# EAGLE design TSS_Rev3 (EAGLE 7.5.0)
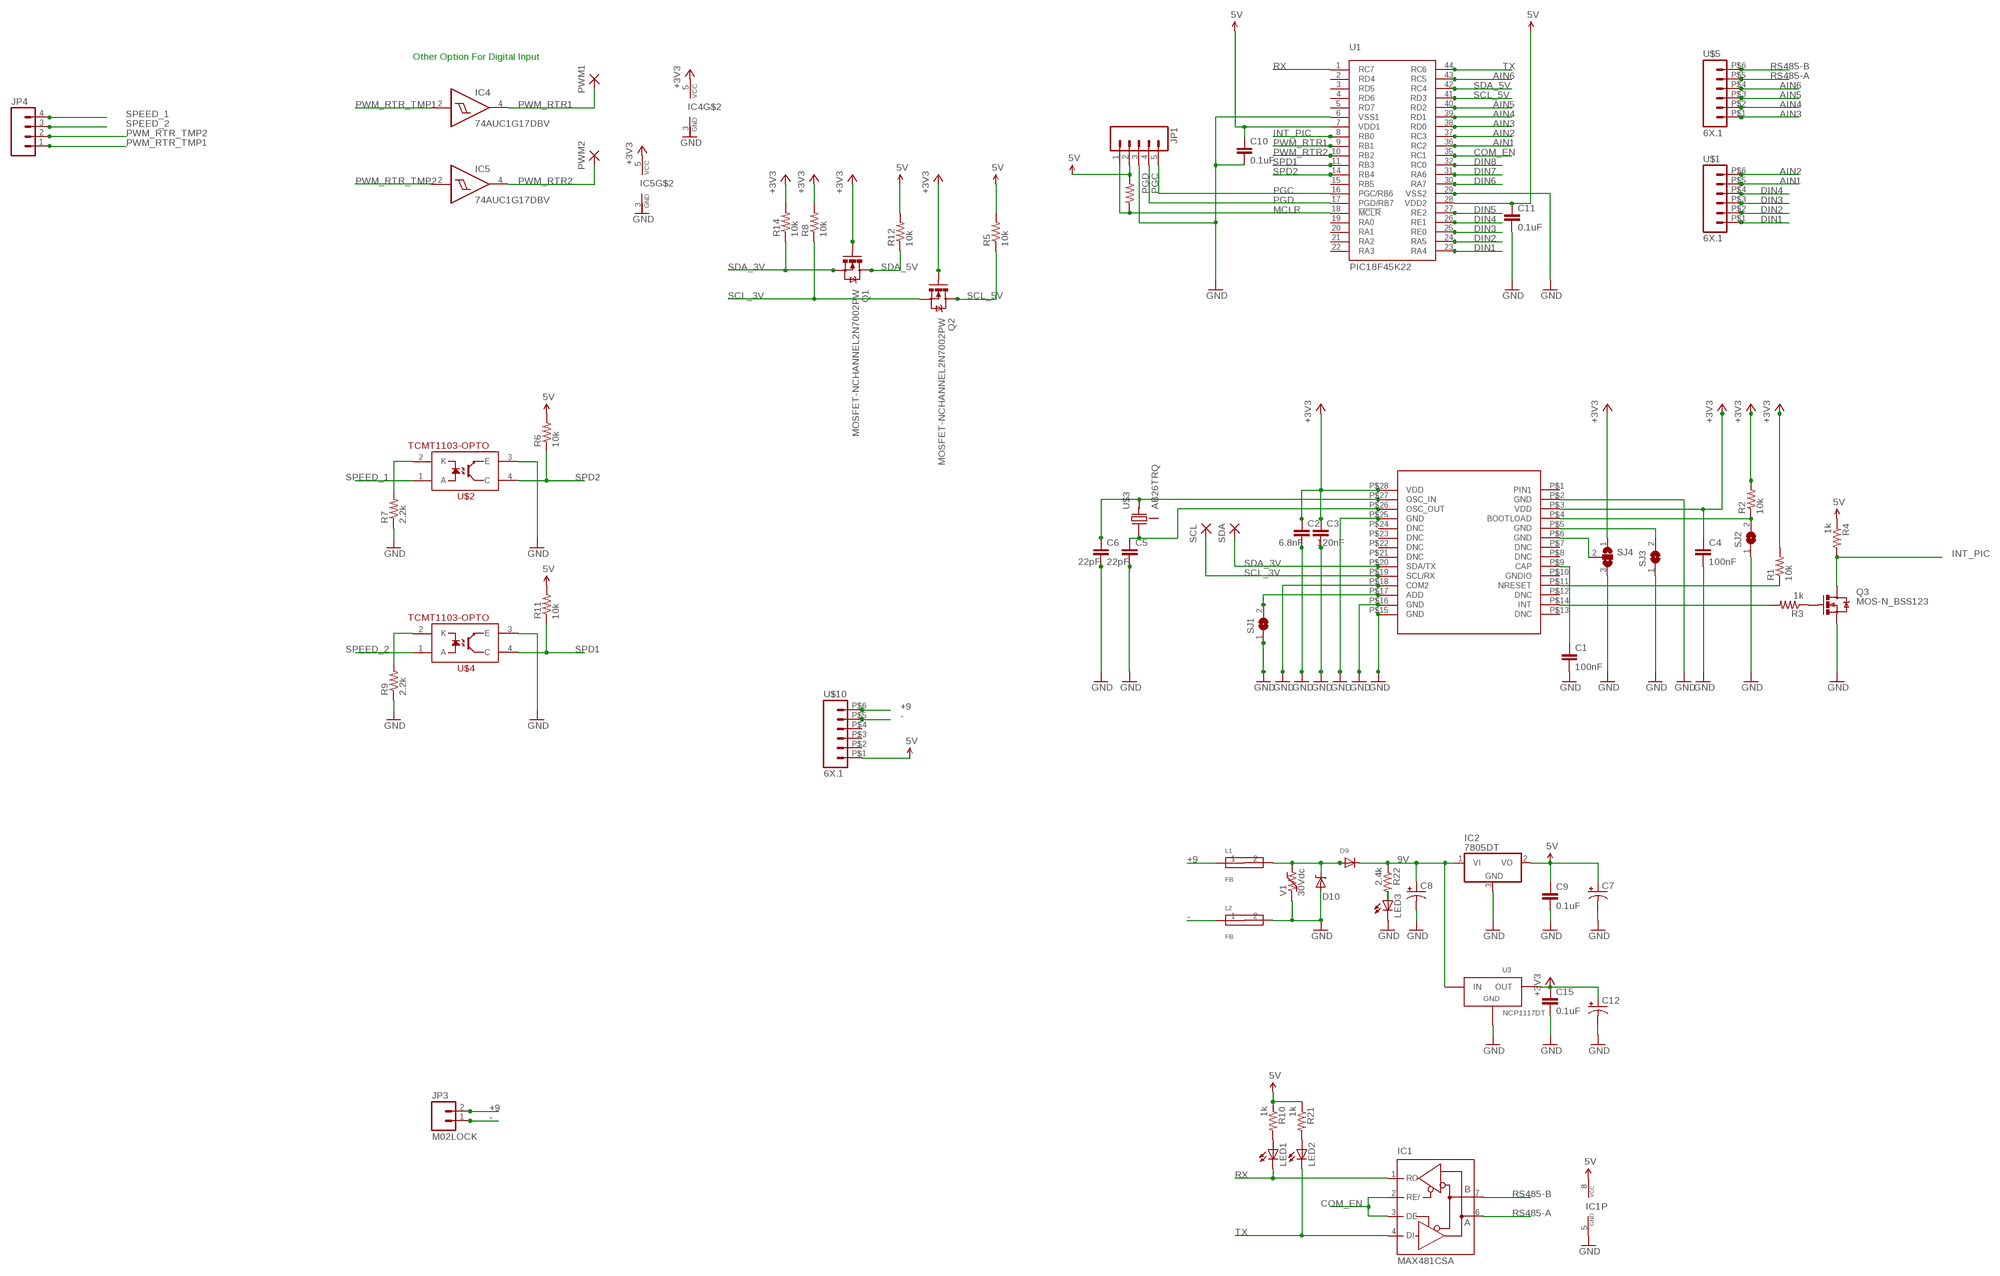
[diagram p0: schematic, sheet 1]

## Parts
C1  100nF  CAP0805  [0805]
C2  6.8nF  CAP0805  [0805]
C3  120nF  CAP0805  [0805]
C4  100nF  CAP0805  [0805]
C5  22pF  CAP0805  [0805]
C6  22pF  CAP0805  [0805]
C7  CPOL-USCT3528  [CT3528]
C8  CAP_POL7343  [EIA7343]
C9  0.1uF  CAP0805  [0805]
C10  0.1uF  CAP0805  [0805]
C11  0.1uF  CAP0805  [0805]
C12  CPOL-USCT3528  [CT3528]
C15  0.1uF  CAP0805  [0805]
D9  DIODESOD-123  [SOD-123]
D10  MM5Z30  [SOD-523F]
IC1  MAX481CSA  [SO08]
IC2  7805DT  [TO252]
IC4  74AUC1G17DBV  [SOT23-5]
IC5  74AUC1G17DBV  [SOT23-5]
JP1  M05LOCK  [1X05_LOCK]
JP3  M02LOCK  [1X02_LOCK]
JP4  M04LOCK  [1X04_LOCK]
L1  FB  FERITEBEAD  [0603]
L2  FB  FERITEBEAD  [0603]
LED1  LEDCHIP-LED0805  [CHIP-LED0805]
LED2  LEDCHIP-LED0805  [CHIP-LED0805]
LED3  LEDCHIP-LED0805  [CHIP-LED0805]
PWM1  TPSMD  [0603]
PWM2  TPSMD  [0603]
Q1  MOSFET-NCHANNEL2N7002PW  [SOT323]
Q2  MOSFET-NCHANNEL2N7002PW  [SOT323]
Q3  MOS-N_BSS123  [SOT23]
R1  10k  RESISTOR0805-RES  [0805]
R2  10k  RESISTOR0805-RES  [0805]
R3  1k  RESISTOR0805-RES  [0805]
R4  1k  RESISTOR0805-RES  [0805]
R5  10k  RESISTOR0805-RES  [0805]
R6  10k  RESISTOR0805-RES  [0805]
R7  2.2k  RESISTOR0805-RES  [0805]
R8  10k  RESISTOR0805-RES  [0805]
R9  2.2k  RESISTOR0805-RES  [0805]
R10  1k  RESISTOR0805-RES  [0805]
R11  10k  RESISTOR0805-RES  [0805]
R12  10k  RESISTOR0805-RES  [0805]
R13  10k  RESISTOR0805-RES  [0805]
R14  10k  RESISTOR0805-RES  [0805]
R21  1k  RESISTOR0805-RES  [0805]
R22  2.4k  RESISTOR0805-RES  [0805]
SCL  TPSMD  [0603]
SDA  TPSMD  [0603]
SJ1  SJ  [SJ]
SJ2  SJ  [SJ]
SJ3  SJ  [SJ]
SJ4  SJ2W  [SJ_2]
U1  PIC18F45K22  [TQFP-44]
U2  BOSCH_IMUSURFACEMOUNT  [LGA_28]
U3  NCP1117DT  [DPAK]
U$1  6X.1  [1X06]
U$2  TCMT1103-OPTO  [SSOP-4]
U$3  AB26TRQ  [3PAD_CAN]
U$4  TCMT1103-OPTO  [SSOP-4]
U$5  6X.1  [1X06]
U$10  6X.1  [1X06]
V1  30Vdc  VAR-RES  [0603]

## Nets
5V: C7.+ C9.1 C10.1 C11.1 IC1.8(VCC) IC2.2(VO) JP1.2 R4.1 R5.2 R6.2 R10.1 R11.2 R12.2 R13.2 R21.1 U1.7(VDD1) U1.28(VDD2) U$10.P$1
9V: C8.A(+) D9.C IC2.1(VI) R22.1 U3.3(IN)
+3V3: C2.1 C3.1 C4.1 C12.+ C15.1 IC4.5(VCC) IC5.5(VCC) Q1.1(G) Q2.1(G) R1.2 R2.2 R8.2 R14.2 SJ4.1 U2.P$3(VDD) U2.P$28(VDD) U3.2(OUT)
+9: JP3.2 L1.1 U$10.P$6
-: JP3.1 L2.1 U$10.P$5
AIN1: U1.36(RC2) U$1.P$5
AIN2: U1.37(RC3) U$1.P$6
AIN3: U1.38(RD0) U$5.P$1
AIN4: U1.39(RD1) U$5.P$2
AIN5: U1.40(RD2) U$5.P$3
AIN6: U1.43(RC5) U$5.P$4
COM_EN: IC1.2(RE/) IC1.3(DE) U1.35(RC1)
DIN1: U1.23(RA4) U$1.P$1
DIN2: U1.24(RA5) U$1.P$2
DIN3: U1.25(RE0) U$1.P$3
DIN4: U1.26(RE1) U$1.P$4
DIN5: U1.27(RE2)
DIN6: U1.30(RA7)
DIN7: U1.31(RA6)
DIN8: U1.32(RC0)
GHT: D9.A D10.C L1.2 V1.2
GND: C1.2 C2.2 C3.2 C4.2 C5.2 C6.2 C7.- C8.C(-) C9.2 C10.2 C11.2 C12.- C15.2 D10.A IC1.5(GND) IC2.3(GND) JP1.3 L2.2 LED3.C Q3.2(S) R7.1 R9.1 SJ1.1 SJ2.1 SJ3.1 SJ4.3 U1.6(VSS1) U1.29(VSS2) U2.P$2(GND) U2.P$15(GND) U2.P$16(GND) U2.P$18(COM2) U2.P$25(GND) U3.1(GND) U$2.3(E) U$4.3(E) V1.1
INT_PIC: Q3.3(D) R4.2 U1.8(RB0)
MCLR: JP1.1 R13.1 U1.18(!MCLR)
N$1: SJ3.2 U2.P$5(GND)
N$2: R2.1 SJ2.2 U2.P$4(BOOTLOAD)
N$3: SJ4.2 U2.P$6(GND)
N$4: LED3.A R22.2
N$5: LED1.A R10.2
N$6: LED2.A R21.2
N$10: C6.1 U2.P$27(OSC_IN) U$3.2(OUT)
N$11: C5.1 U2.P$26(OSC_OUT) U$3.1(IN)
N$12: R7.2 U$2.2(K)
N$13: SJ1.2 U2.P$17(ADD)
N$14: R9.2 U$4.2(K)
N$15: R3.2 U2.P$14(INT)
N$16: C1.1 U2.P$9(CAP)
N$17: R1.1 U2.P$11(NRESET)
N$18: Q3.1(G) R3.1
PGC: JP1.5 U1.16(PGC/RB6)
PGD: JP1.4 U1.17(PGD/RB7)
PWM_RTR1: IC4.4(O) PWM1.1 PWM1.2 U1.9(RB1)
PWM_RTR2: IC5.4(O) PWM2.1 PWM2.2 U1.10(RB2)
PWM_RTR_TMP1: IC4.2(I) JP4.1
PWM_RTR_TMP2: IC5.2(I) JP4.2
RS485-A: IC1.6(A) U$5.P$5
RS485-B: IC1.7(B) U$5.P$6
RX: IC1.1(RO) LED1.C U1.1(RC7)
SCL_3V: Q2.2(S) R8.1 SCL.1 SCL.2 U2.P$19(SCL/RX)
SCL_5V: Q2.3(D) R5.1 U1.41(RD3)
SDA_3V: Q1.2(S) R14.1 SDA.1 SDA.2 U2.P$20(SDA/TX)
SDA_5V: Q1.3(D) R12.1 U1.42(RC4)
SPD1: R11.1 U1.11(RB3) U$4.4(C)
SPD2: R6.1 U1.14(RB4) U$2.4(C)
SPEED_1: JP4.4 U$2.1(A)
SPEED_2: JP4.3 U$4.1(A)
TX: IC1.4(DI) LED2.C U1.44(RC6)
Unconnected: U1.2(RD4) U1.3(RD5) U1.4(RD6) U1.5(RD7) U1.15(RB5) U1.19(RA0) U1.20(RA1) U1.21(RA2) U1.22(RA3) U2.P$1(PIN1) U2.P$7(DNC) U2.P$8(DNC) U2.P$10(GNDIO) U2.P$12(DNC) U2.P$13(DNC) U2.P$21(DNC) U2.P$22(DNC) U2.P$23(DNC) U2.P$24(DNC) U$3.CASE(GND) U$10.P$2 U$10.P$3 U$10.P$4

## Notes on the sheet
- Other Option For Digital Input

## Power pins joined to a net without a drawn wire
GND: IC4.3(GND) IC5.3(GND)

## Library data of the parts
C1-C6 C9-C11 C15 = SparkFun-Passives:CAP: Capacitor Standard 0603 ceramic capacitor, and 0.1" leaded capacitor.
C7 C12 = adafruit:CPOL-US: POLARIZED CAPACITOR, American symbol
C8 = SparkFun-Passives:CAP_POL: Capacitor Polarized These are standard SMD and PTH capacitors. Normally 10uF, 47uF, and 100uF in electrolytic and tantalum varieties. Always verify the external diameter of the through hole cap, it varies with capacity, voltage, and manufacturer. The EIA devices should be standard.
D9 = adafruit:DIODE: Diode SMADIODE - SMA Surface Mount Package 20V 1A Schottky Diode Digikey: 641-1014-6-ND DO-1N4148 - Through Hole Small Current Diode SOD-123 20V 1 A (.5mV Vf) Schottky Diode - Digikey: MBRX120TPMSCT-ND SOD-323 10V 570mA (.38mV Vf, 3ns) Schottky Diode - Digikey: ZLLS410CT-ND SOD-523 30V 30mA Schottky Diode (RB751S-40TE61) - Digikey: RB751S-40TE61CT-ND SOT23-R/W - SOT23 Package (R = Solder Paste/Reflow Ovens, W = Hand-Soldering) BAT54Film 40V 300mA - Digikey: 497-7162-1-ND
D10 = EmEndev:MM5Z30
IC1 = maxim:MAX481CSA: RS485 TRANSEIVER; MF: MAXIM; MPN: MAX481CSA; OC_FARNELL: unknown; OC_NEWARK: 90C3817
IC2 = adafruit:78*: Positive VOLTAGE REGULATOR Added bigger pads to the TO-92 package
IC4 IC5 = 74xx-little-us:74*1G17: Single Schmitt-Trigger Buffer
JP1 = SparkFun-Connectors:M05: Header 5 Standard 5-pin 0.1" header. Use with straight break away headers (SKU : PRT-00116), right angle break away headers (PRT-00553), swiss pins (PRT-00743), machine pins (PRT-00117), and female headers (PRT-00115). Molex polarized connector foot print use with SKU : PRT-08230 with associated crimp pins and housings.
JP3 = SparkFun-Connectors:M02: Standard 2-pin 0.1" header. Use with - straight break away headers ( PRT-00116) - right angle break away headers (PRT-00553) - swiss pins (PRT-00743) - machine pins (PRT-00117) - female headers (PRT-00115) Molex polarized connector foot print use with: PRT-08233 with associated crimp pins and housings. 2.54_SCREWTERM for use with PRT-10571. 3.5mm Screw Terminal footprints for PRT-08084 5mm Screw Terminal footprints for use with PRT-08432
JP4 = SparkFun-Connectors:M04: Header 4 Standard 4-pin 0.1" header. Use with straight break away headers (SKU : PRT-00116), right angle break away headers (PRT-00553), swiss pins (PRT-00743), machine pins (PRT-00117), and female headers (PRT-00115). Molex polarized connector foot print use with SKU : PRT-08231 with associated crimp pins and housings. 1MM SMD Version SKU: PRT-10208
L1 L2 = EmEndev:FERITEBEAD
LED1-LED3 = adafruit:LED: LED OSRAM: - CHIPLED LG R971, LG N971, LY N971, LG Q971, LY Q971, LO R971, LY R971 LH N974, LH R974 LS Q976, LO Q976, LY Q976 LO Q996 - Hyper CHIPLED LW Q18S LB Q993, LB Q99A, LB R99A - SideLED LS A670, LO A670, LY A670, LG A670, LP A670 LB A673, LV A673, LT A673, LW A673 LH A674 LY A675 LS A676, LA A676, LO A676, LY A676, LW A676 LS A679, LY A679, LG A679 - Hyper Micro SIDELED® LS Y876, LA Y876, LO Y876, LY Y876 LT Y87S - SmartLED LW L88C, LW L88S LB L89C, LB L89S, LG L890 LS L89K, LO L89K, LY L89K LS L896, LA L896, LO L896, LY L896 - TOPLED LS T670, LO T670, LY T670, LG T670, LP T670 LSG T670, LSP T670, LSY T670, LOP T670, LYG T670 LG T671, LOG T671, LSG T671 LB T673, LV T673, LT T673, LW T673 LH T674 LS T676, LA T676, LO T676, LY T676, LB T676, LH T676, LSB T676, LW T676 LB T67C, LV T67C, LT T67C, LS T67K, LO T67K, LY T67K, LW E67C LS E67B, LA E67B, LO E67B, LY E67B, LB E67C, LV E67C, LT E67C LW T67C LS T679, LY T679, LG T679 LS T770, LO T770, LY T770, LG T770, LP T770 LB T773, LV T773, LT T773, LW T773 LH T774 LS E675, LA E675, LY E675, LS T675 LS T776, LA T776, LO T776, LY T776, LB T776 LHGB T686 LT T68C, LB T68C - Hyper Mini TOPLED® LB M676 - Mini TOPLED Santana® LG M470 LS M47K, LO M47K, LY M47K Source: http://www.osram.convergy.de/
PWM1 PWM2 SCL SDA = FSAE Electric:TP: SMD test points to make life easy to test / debug; PARTNO: 1625854-3
Q1 Q2 = SparkFun-DiscreteSemi:MOSFET-NCHANNEL: Common NMOSFET Parts MFG P/N Store ID Prod ID FDD8780 TRANS-09984 SI7820DN TRANS-11055 FDS6630A IC-08089 2N7002PW TRANS-11151 FQP30N06L COM-10213 TRANS-10060 BSS123LT1G TRANS-08345 BSS138 TRANS-00830 BS170 2N7000; PROD_ID: TRANS-11151
Q3 = FSAE Electric:MOS-N: N-Channel Mosfets; PARTNO: BSS123,215
R1-R14 R21 R22 = SparkFun-Passives:RESISTOR: Resistor Basic schematic elements and footprints for 0603, 1206, and PTH resistors.
SJ1-SJ3 = jumper:SJ: SMD solder JUMPER
SJ4 = jumper:SJ2W: SMD solder JUMPER
U1 = FSAE Eletric:PIC18F45K22
U2 = Drockton:BOSCH_IMU
U3 = FSAE Eletric:NCP1117DT
U$1 U$5 U$10 = FSAE Electric:6X.1: 6x1 .1 header; PARTNO: 952-2270-ND
U$2 U$4 = SparkFun-DiscreteSemi:TCMT1103-OPTO: Optoisolator- NPN output
U$3 = FSAE Electric:AB26TRQ; PARTNO: 535-12051-1-ND
V1 = EmEndev:VAR-RES

## Board
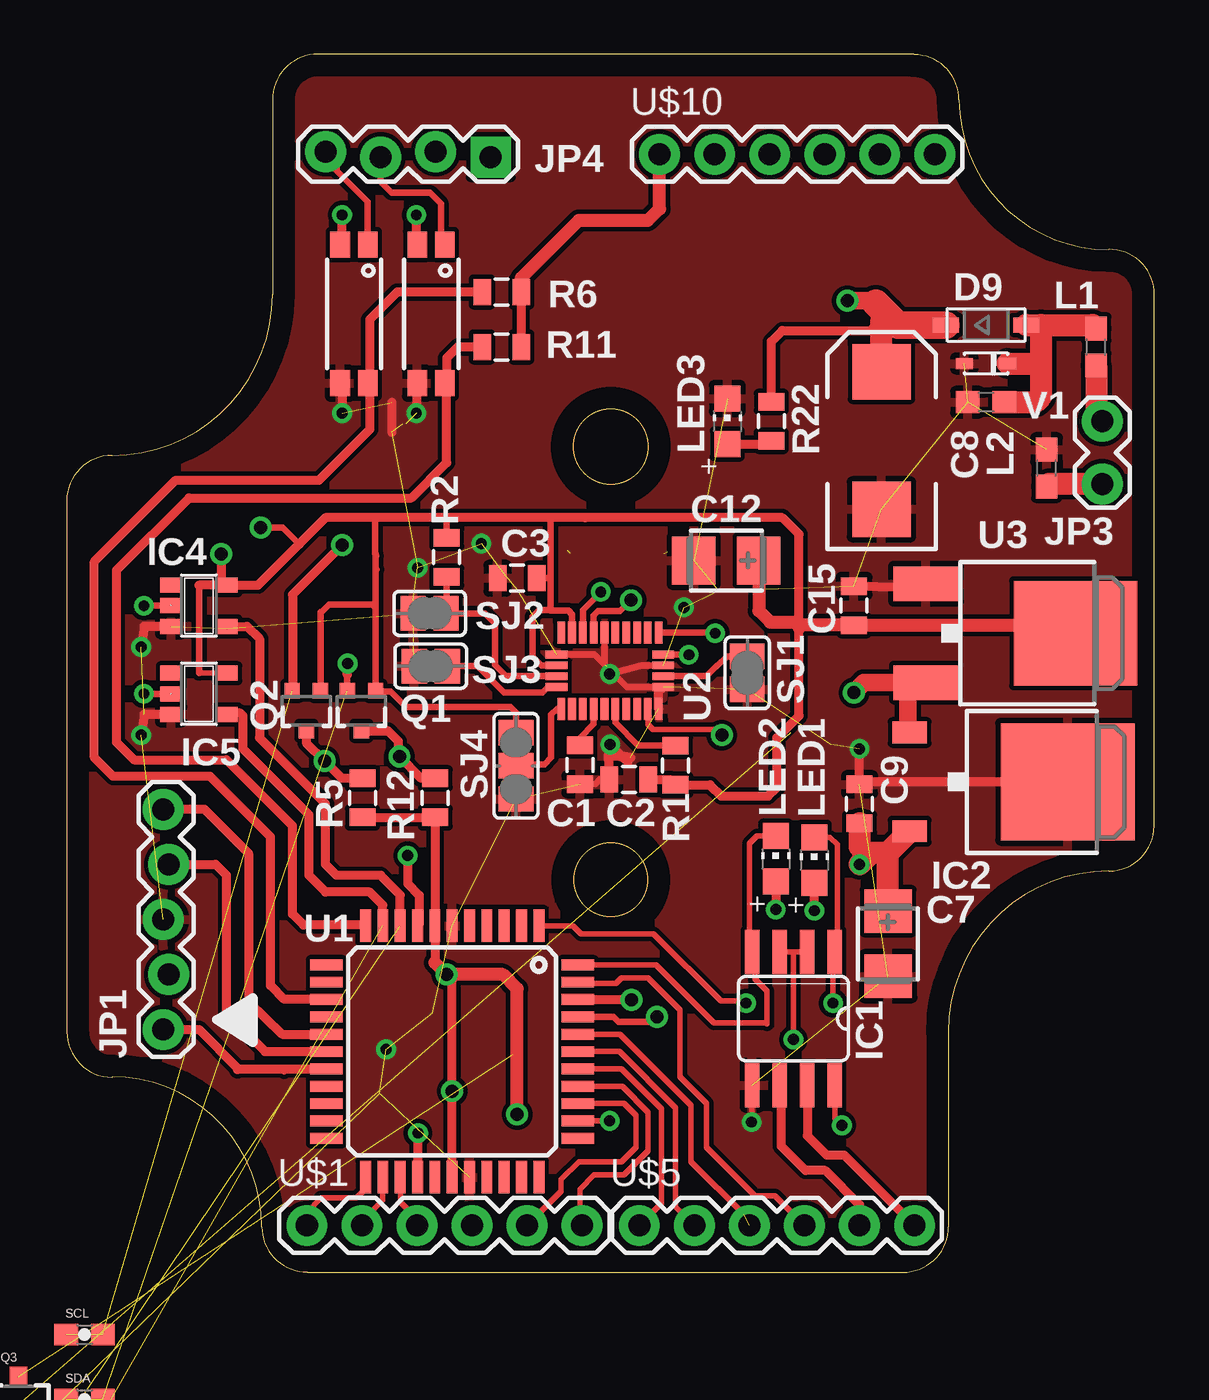
[diagram p1: board, top side]
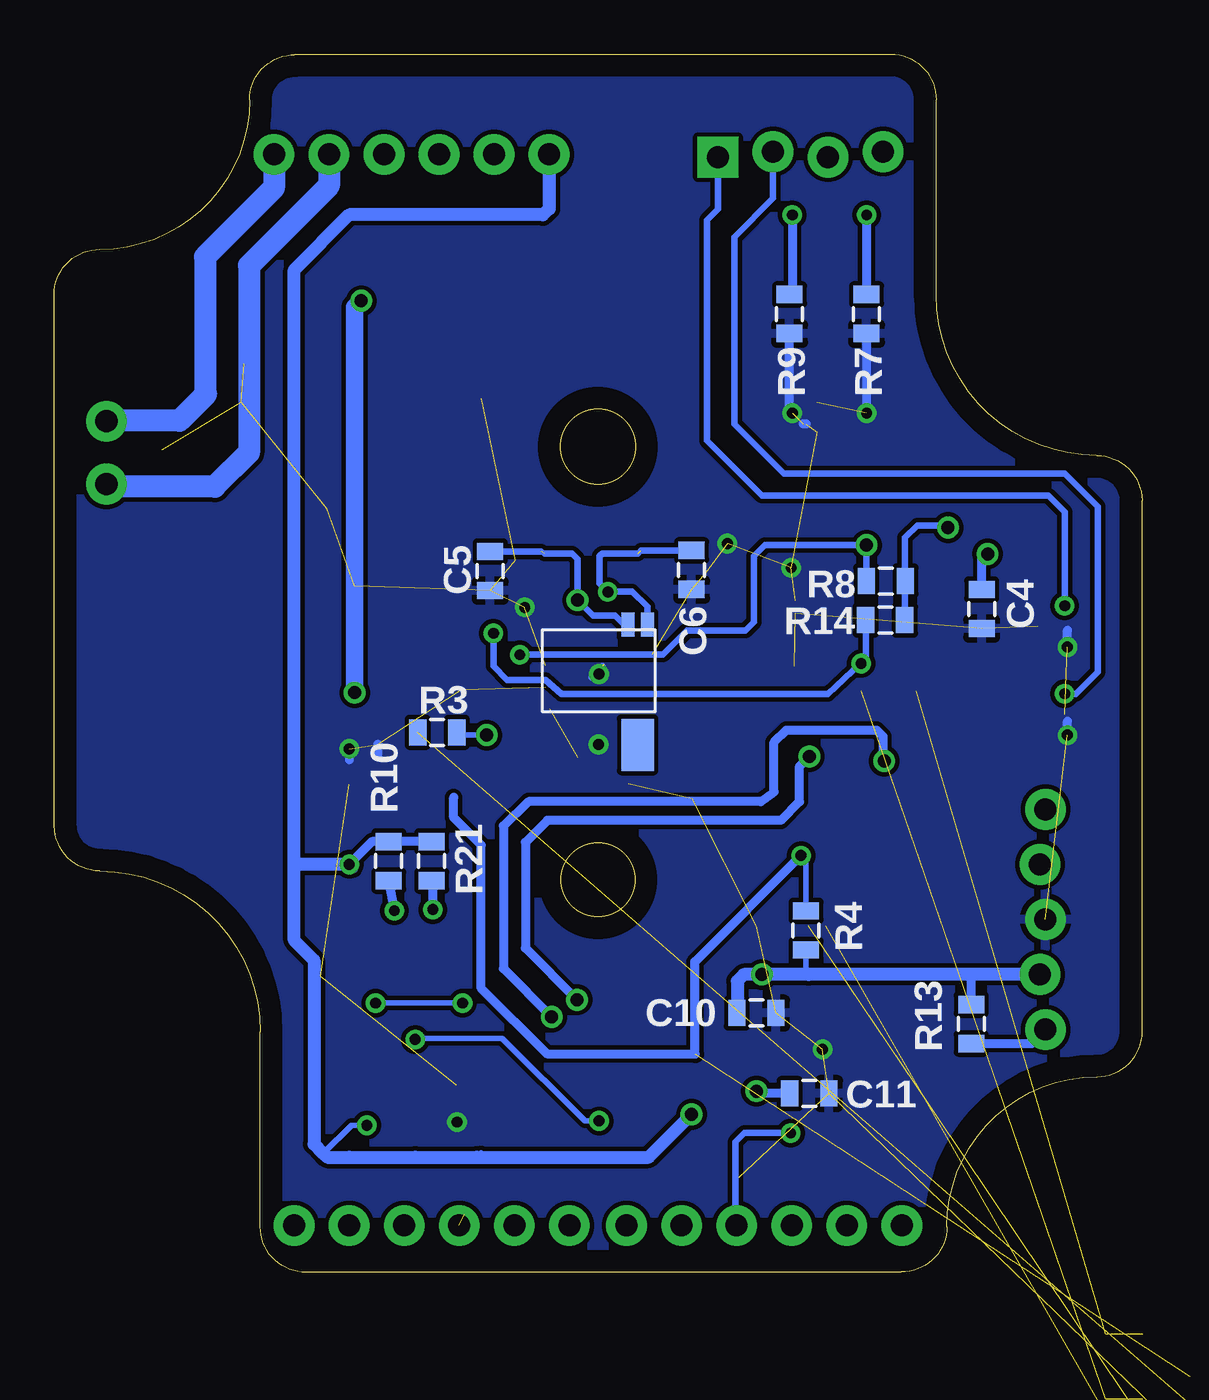
[diagram p2: board, bottom side, seen from below]

Size 50.2 x 56.21 mm. Coordinates in mm from the lower left corner, seen from the top.
Outline: 50.2,20.6 50.2,45.11 arc90 48.09,47.21
Outline: 40.7,2.11 40.7,11.1
Outline: 11.11,0 38.6,0 arc90 40.69,2.11
Outline: 0.01,35.61 0.01,11.1 arc90 2.1,9
Outline: 9.51,54.1 9.51,45.11
Outline: 39.1,56.21 11.59,56.21 arc90 9.5,54.1
Outline: 50.19,20.6 arc-90 48.09,18.52 arc90 40.69,11.1
Outline: 11.11,0.01 arc-90 9,2.11 arc90 2.1,9.02
Outline: 0,35.61 arc-90 2.1,37.69 arc90 9.5,45.11
Outline: 39.1,56.18 arc-90 41.19,54.1 arc90 48.09,47.19
Outline: circle at 25.11,18.11 radius 1.7
Outline: circle at 25.11,38.1 radius 1.73
Copper layers (1*16): Top 0.035mm / dielectric 1.5mm / Bottom 0.035mm
Design rules "default": minimum track width 10mil, minimum drill 24mil, track to track 8mil, track to pad 8mil, pad to pad 8mil, via to via 8mil, smd to smd 8mil, copper to edge 40mil, drill to drill 8mil, minimum pad ring 10mil, minimum via ring 8mil, stop-mask expansion 4mil, vias tented up to drill 0mil, thermal gap 10mil

### Footprints (pad centres in the part's own frame; a part is rotated, then mirrored left to right if it is on the bottom)
0805 = smd 0.8 x 1.2: 1 -0.9,0; 2 0.9,0
CT3528 = smd 2 x 2.2: + 1.5,0; - -1.5,0
EIA7343 = smd 2.55 x 2.7: A 3.17,0; C -3.17,0
SOD-123 = smd 1.2 x 0.7: A 1.85,0; C -1.85,0
SOD-523F = smd 0.8 x 0.5: A -1,0; C 1,0
SO08 = smd 0.66 x 2.032: 1 -1.905,-3.073; 2 -0.635,-3.073; 3 0.635,-3.073; 4 1.905,-3.073; 5 1.905,3.073; 6 0.635,3.073; 7 -0.635,3.073; 8 -1.905,3.073
TO252 = smd 1 x 1.6: 1 -2.28,-4.8; 2 2.28,-4.8 | smd 5.4 x 6.2: 3 0,2.5
SOT23-5 = smd 0.69 x 0.99: 1 -0.95,-1.29; 2 0,-1.29; 3 0.95,-1.29; 4 0.95,1.3; 5 -0.95,1.3
1X05_LOCK = drill 1.016 pad 1.88: 1 0,0.127; 2 2.54,-0.127; 3 5.08,0.127; 4 7.62,-0.127; 5 10.16,0.127
1X02_LOCK = drill 1.016 pad 1.88: 1 -0.178,0; 2 2.718,0
1X04_LOCK = drill 1.016 pad 1.88 square: 1 0,0.127 | drill 1.016 pad 1.88: 2 2.54,-0.127; 3 5.08,0.127; 4 7.62,-0.127
0603 = smd 1.1 x 1: 1 -0.85,0; 2 0.85,0
CHIP-LED0805 = smd 1.2 x 1.2: A 0,-1.05; C 0,1.05
SOT323 = smd 0.7 x 0.7: 1 -0.65,-0.925; 2 0.65,-0.925; 3 0,0.925
SOT23 = smd 0.8 x 0.9: 1 -0.95,-1; 2 0.95,-1; 3 0,1.1
SJ = smd 1.168 x 1.6: 1 -0.762,0; 2 0.762,0
SJ_2 = smd 1.168 x 1.6: 1 -1.524,0; 2 0,0; 3 1.524,0
TQFP-44 = smd 1.5 x 0.5: 1 -5.8,4; 2 -5.8,3.2; 3 -5.8,2.4; 4 -5.8,1.6; 5 -5.8,0.8; 6 -5.8,0; 7 -5.8,-0.8; 8 -5.8,-1.6; 9 -5.8,-2.4; 10 -5.8,-3.2; 11 -5.8,-4; 23 5.8,-4; 24 5.8,-3.2; 25 5.8,-2.4; 26 5.8,-1.6; 27 5.8,-0.8; 28 5.8,0; 29 5.8,0.8; 30 5.8,1.6; 31 5.8,2.4; 32 5.8,3.2; 33 5.8,4 | smd 0.5 x 1.5: 12 -4,-5.8; 13 -3.2,-5.8; 14 -2.4,-5.8; 15 -1.6,-5.8; 16 -0.8,-5.8; 17 0,-5.8; 18 0.8,-5.8; 19 1.6,-5.8; 20 2.4,-5.8; 21 3.2,-5.8; 22 4,-5.8; 34 4,5.8; 35 3.2,5.8; 36 2.4,5.8; 37 1.6,5.8; 38 0.8,5.8; 39 0,5.8; 40 -0.8,5.8; 41 -1.6,5.8; 42 -2.4,5.8; 43 -3.2,5.8; 44 -4,5.8
LGA_28 = smd 0.35 x 1: P$1 -2.31,1.758; P$6 -2.31,-1.768; P$7 -1.81,-1.768; P$8 -1.31,-1.768; P$9 -0.81,-1.768; P$10 -0.31,-1.768; P$11 0.19,-1.768; P$12 0.69,-1.768; P$13 1.19,-1.768; P$14 1.69,-1.768; P$15 2.19,-1.768; P$20 2.19,1.758; P$21 1.69,1.758; P$22 1.19,1.758; P$23 0.69,1.758; P$24 0.19,1.758; P$25 -0.31,1.758; P$26 -0.81,1.758; P$27 -1.31,1.758; P$28 -1.81,1.758 | smd 1 x 0.35: P$2 -2.522,0.745; P$3 -2.522,0.245; P$4 -2.522,-0.255; P$5 -2.522,-0.755; P$16 2.402,-0.755; P$17 2.402,-0.255; P$18 2.402,0.245; P$19 2.402,0.745
DPAK = smd 1.6 x 3: 1 -2.28,-4.04; 3 2.28,-4.04 | smd 4.826 x 5.715: 2 0,2.858
1X06 = drill 1.016 pad 1.88: P$1 0,0; P$2 2.54,0; P$3 5.08,0; P$4 7.62,0; P$5 10.16,0; P$6 12.7,0
SSOP-4 = smd 1.2 x 0.9: 1 -3.2,0.67; 2 -3.2,-0.6; 3 3.2,-0.6; 4 3.2,0.67
3PAD_CAN = smd 1.1 x 0.6: 1 0.55,0.45; 2 0.55,-0.45 | smd 2.4 x 1.5: CASE -5,0

### Placement (x,y rotation side)
C1  23.69,23.42 270 top
C2  25.95,22.73 180 top
C3  20.79,32.03 180 top
C4  7.4,30.61 270 bottom
C5  30.09,32.36 270 bottom
C6  20.79,32.41 270 bottom
C7  37.91,15.16 90 top
C8  37.6,38.38 90 top
C9  36.59,21.62 90 top
C10  17.79,11.96 0 bottom
C11  15.35,8.25 0 bottom
C12  30.44,32.84 0 top
C15  36.33,30.76 90 top
D9  42.43,43.71 0 top
D10  42.43,41.94 0 top
IC1  33.54,11.71 180 top
IC2  43.7,22.63 270 top
IC4  6.11,30.76 270 top
IC5  6.11,26.7 270 top
JP1  4.58,11.2 90 top
JP3  47.79,36.55 90 top
JP4  19.57,51.59 180 top
L1  47.51,42.7 90 top
L2  45.22,37.11 90 top
LED1  34.51,19.02 0 top
LED2  32.73,19.08 0 top
LED3  30.49,39.27 0 top
PWM1  -2.22,-8.86 0 top  (outside the outline)
PWM2  -2.22,-11.86 0 top  (outside the outline)
Q1  13.6,25.91 180 top
Q2  11.06,25.91 180 top
Q3  -2.22,-5.92 0 top  (outside the outline)
R1  28.11,23.39 270 top
R2  17.54,32.99 90 top
R3  32.52,24.92 0 bottom
R4  15.51,15.77 90 bottom
R5  13.65,21.89 270 top
R6  20.08,45.24 0 top
R7  12.71,44.22 90 bottom
R8  11.82,31.9 0 bottom
R9  16.27,44.22 90 bottom
R10  34.76,18.97 270 bottom
R11  20.08,42.7 0 top
R12  17.01,21.89 270 top
R13  7.89,11.46 90 bottom
R14  11.85,30.1 0 bottom
R21  32.78,18.97 270 bottom
R22  32.52,39.27 270 top
SCL  0.83,-2.87 0 top
SDA  0.83,-5.87 0 top  (outside the outline)
SJ1  31.41,27.66 90 top
SJ2  16.75,30.4 0 top
SJ3  16.8,27.97 0 top
SJ4  20.74,23.37 270 top
U1  17.79,10.19 270 top
U2  25.13,27.76 0 top
U3  43.7,29.49 270 top
U$1  11.09,2.16 0 top
U$2  13.22,44.22 270 top
U$3  23.28,29.34 90 bottom
U$4  16.78,44.22 270 top
U$5  26.43,2.16 0 top
U$10  27.36,51.59 0 top
V1  42.43,40.16 0 top

### Tracks (layer width: path | path; a pad name or v marks a point on that pad's centre or on a via)
5V  (via drill 0.5, 0.6)
  Top 0.254: IC1.8 35.45,7.11 v35.78,6.78
  Top 0.305: U1.7 16.94,15.99
  Top 0.406: R6.2 R11.2 | R5.2 R12.2 17.01,16 U1.7 16.99,14.29 | U1.28 v17.79,8.36 17.79,13.49 v17.54,13.74
  Top 0.61: R6.2 20.98,45.88 23.63,48.54 26.82,48.54 27.36,49.08 U$10.P$1 | 16.99,14.29 v17.54,13.74 20.13,13.74 20.79,13.08 v20.79,7.29
  Top 1.016: C7.+ 37.91,19.36 | 37.91,19.36 IC2.2 | 37.91,19.36 37.13,19.36 36.99,19.23 | 36.99,19.23 v36.59,18.82 | C9.1 36.59,19.63 36.99,19.23
  Bottom 0.254: R4.1 15.51,13.87 15.38,13.74 | 36.69,5.41 36.59,5.31 | 30.49,5.51 30.7,5.31 | v35.78,6.78 36.49,6.78 37.78,5.49
  Bottom 0.406: 33.64,5.21 33.54,5.31 | C11.1 17.69,8.26 v17.79,8.36 | R13.2 7.89,13.69 7.84,13.74 | 36.39,18.62 v36.59,18.82 35.54,19.87 R10.1 R21.1
  Bottom 0.61: 39.13,18.67 39.13,15.32 38.21,14.4 38.21,5.92 37.78,5.49 37.6,5.31 36.59,5.31 33.54,5.31 30.7,5.31 22.77,5.31 v20.79,7.29 | 39.13,18.67 39.13,46.25 36.59,48.79 27.65,48.79 27.36,49.08 U$10.P$1 | C10.1 18.68,11.97 18.68,13.44 18.38,13.74 v17.54,13.74 15.38,13.74 7.84,13.74 JP1.2 | v36.59,18.82 38.98,18.82 39.13,18.67
9V  (via drill 0.6)
  Top 0.406: IC2.1 38.87,24.91 | 38.87,26.95 39.66,26.95 U3.3 | 37.35,43.71 37.73,44.09 37.86,44.22 | 36.84,42.19 37.35,42.7 37.35,43.71 | R22.1 32.52,42.95 33.03,43.46 37.1,43.46 37.35,43.71
  Top 0.813: U3.3 39.08,27.21 | 39.08,27.21 38.82,26.95 38.82,24.99 IC2.1 | 39.08,27.21 36.8,27.21 v36.33,26.75 | v36.03,44.83 36.99,44.83 37.73,44.09
  Top 1.016: C8.A 37.6,43.97 37.73,44.09
  Top 1.27: 37.35,44.73 37.86,44.22 38.37,43.71 D9.C
  Bottom 0.813: v36.33,26.75 36.33,44.53 v36.03,44.83
+3V3  (via drill 0.6)
  Top 0.254: 7.41,27.46 IC5.5 6.11,27.65
  Top 0.305: 6.11,31.71 6.11,27.65 | U2.P$3 21.92,28.01 21.5,28.42 21.5,30.25 21.81,30.56 22.31,30.56 22.34,30.53 | 22.34,30.53 22.34,32.03 | 22.34,32.03 22.34,34.8 23.94,34.82 | 7.51,31.81 IC4.5 | C3.1 22.34,32.03 | Q1.1 14.25,27.85 | Q2.1 11.71,30.47 11.76,30.47 12.1,30.81 14.1,30.81 14.25,30.66 | 22.34,30.53 23.15,30.53 23.33,30.35 23.33,29.53 U2.P$28 | v8.95,34.37 9.97,34.37 10.73,33.6 | 14.29,33.05 14.24,33.2 | 14.24,33.2 14.24,34.82 | Q1.1 14.25,30.66 | 14.25,30.66 14.25,32.39 | 14.25,32.39 14.25,33.16 14.24,33.2 | 14.3,32.44 14.25,32.39 | SJ4.1 20.74,25.83 20.48,26.09 15.66,26.09 14.95,26.8 14.29,26.8 Q1.1 | R2.2 17.54,34.72 17.64,34.82
  Top 0.406: 46.56,29.91 U3.2 | 33.79,29.74 33.79,25.68 32.78,24.66 32.78,22.38 32.37,21.97 30.21,21.97 29.69,22.49 R1.2 27.87,22.73 C2.1 | IC4.5 6.11,31.71 | 33.79,29.74 33.79,29.95 33.79,34.06 33.03,34.82 23.94,34.82 17.64,34.82 14.24,34.82 11.95,34.82 10.73,33.6 8.84,31.71 IC4.5 | 33.81,30.01 33.79,29.74 | v7.12,33.15 7.12,31.99 IC4.5
  Top 0.61: 33.79,29.74 33.91,29.86 C15.1 46.19,29.86 U3.2 | C12.+ 31.94,30.53 32.47,30 33.74,30 33.79,29.95
  Bottom 0.305: R8.2 10.95,31.88 R14.2 10.95,33.89 10.38,34.47 9.05,34.47 v8.95,34.37
  Bottom 0.406: C4.1 7.4,32.87 v7.12,33.15
+9
  Top 1.016: L1.1 47.51,39.55 JP3.2
  Bottom 0.61: 47.76,39.29 JP3.2
  Bottom 1.016: U$10.P$6 40.06,50.04 43.24,46.86 43.24,40.61 43.19,40.56 43.19,40.51 44.41,39.29 47.76,39.29 JP3.2
-
  Top 1.016: JP3.1 45.34,36.37 L2.1
  Bottom 0.61: 47.66,36.25 JP3.1
  Bottom 1.016: U$10.P$5 37.52,50.15 41.21,46.46 41.21,37.82 42.79,36.25 47.66,36.25 JP3.1
AIN1
  Top 0.254: U1.36 25.73,7.79 26.28,7.24 26.28,5.77 25.62,5.11 23.63,5.11 22.82,4.29 22.82,3.73 U$1.P$5
AIN2
  Top 0.254: U1.37 25.64,8.59 26.83,7.39 26.83,5.61 25.72,4.5 24.35,4.5 23.69,3.84 23.69,2.26 U$1.P$6
AIN3
  Top 0.254: U1.38 25.6,9.39 27.44,7.54 27.44,3.18 U$5.P$1
AIN4
  Top 0.254: U1.39 25.51,10.19 28.1,7.59 28.1,3.02 U$5.P$2
AIN5  (1 unrouted)
  Top 0.254: U1.40 25.53,10.99 28.82,7.7 28.82,5.11 31.25,2.67
AIN6
  Top 0.254: U$5.P$4 32.68,3.53 31.76,3.53 29.53,5.77 29.53,7.8 28.31,9.02 28.31,11.86 28.31,12.12 27.04,13.39 26.83,13.59 25.62,13.59 25.36,13.34 23.64,13.34 U1.43
COM_EN  (via drill 0.5)
  Top 0.254: U1.35 v25.06,6.99 | v25.06,6.99 | v33.54,10.74 33.54,14.78 | IC1.3 33.54,14.78 | 33.54,14.78 IC1.2
  Bottom 0.254: v25.06,6.99 25.72,6.99 29.53,10.8 33.49,10.8 v33.54,10.74
DIN1
  Top 0.254: U$1.P$1 11.09,2.77 11.75,3.43 13.37,3.43 13.73,3.78 13.73,4.32 U1.23
DIN2
  Top 0.254: U$1.P$2 13.63,2.36 14.59,3.33 U1.24 | U1.24
DIN3
  Top 0.254: U$1.P$3 16.17,2.46 15.4,3.23 15.4,4.37 U1.25
DIN4  (via drill 0.5)
  Top 0.254: 16.22,4.36 U1.26
  Top 0.406: 16.22,4.36 v16.22,6.43
  Bottom 0.305: v16.22,6.43 18.35,6.43 18.76,6.02 18.76,2.21 U$1.P$4
GHT
  Top 1.016: D9.A 44.97,43.71 | 44.97,43.71 47.34,43.71 L1.2 | V1.2 44.72,40.16 44.97,40.41 44.97,42.19 | 44.97,42.19 44.97,43.71 | D10.C 44.72,41.94 44.97,42.19
GND  (via drill 0.5)  (37 unrouted)
  Top 0.254: IC1.5 31.64,6.96 v31.61,6.93
  Top 0.305: U2.P$18 26.52,28.01 v25.06,27.61 | U2.P$2 24.36,28.51 24.82,28.05 | U2.P$25 24.82,28.05 | U2.P$16 25.86,27.01 24.82,28.05 | C2.2 24.6,22.73 24.4,22.53 23.7,22.53 C1.2 | C3.2 19.89,32.04 20.13,32.28 | SJ2.1 15.99,30.99
  Top 0.406: IC2.3 36.59,22.63 C9.2 v36.59,24.16 | IC5.3 3.57,25.75 v3.44,24.79 | IC4.3 3.57,29.81 v3.44,28.85 | U$2.3 12.71,41.02 v12.71,39.65 | U$4.3 16.14,41.02 v16.14,39.65 | C15.2 39.66,31.61 U3.1 | C2.2 25,23.87 25.06,23.83 25.62,23.83 | 25.62,23.83 25.9,23.55 25.9,23.62 26.02,23.75 25.62,23.83 | 25.62,23.83 v25.08,24.36 | U2.P$15 27.32,26.79 U2.P$16 | 15,40.13 15,38.76
  Bottom 0.254: v31.61,6.93 31.61,6.88 31.66,6.83
  Bottom 0.305: v25.06,27.61 25.41,27.46 24.9,27.97
  Bottom 0.406: v3.44,24.79 3.44,25.43 | v3.44,28.85 3.44,29.62 | 12.46,39.65 v12.71,39.65 | v16.14,39.65 16.27,39.65 R9.1 | R7.1 v12.71,39.65 | v12.71,39.65 12.71,39.4 | v36.59,24.16 36.59,23.65 | 15.51,39.14 15.63,39.14 | 35.27,24.36 35.27,23.85
  other vias: 19.14,33.63 16.19,32.51 14.74,10.29 28.49,30.68
  pour Bottom: -0.5,0.79 -0.5,56.16 49.8,56.16 49.7,-0.03
  pour Top: 10.17,0.03 8.39,1.8 8.39,5.11 8.14,5.36 5.35,8.15 2.04,8.15 0.01,10.19 0.01,36.86 0.77,37.62 4.08,37.62 8.65,42.19 8.65,44.22 9.41,44.98 9.41,54.64 10.68,55.91 40.4,55.91 40.4,55.4 41.67,54.13 41.67,52.1 41.67,51.08 43.95,48.79 44.21,48.79 45.48,47.52 48.27,47.52 50.56,45.24 50.56,20.6 48.53,18.57 45.99,18.57 44.72,17.3 44.46,17.3 42.18,15.01 41.92,15.01 40.91,14 40.91,0.28 40.65,0.03
INT_PIC  (via drill 0.5)  (1 unrouted)
  Top 0.406: v15.74,19.23 15.74,17.93 16.27,17.4 16.27,16.06 U1.8
  Bottom 0.254: R4.2 15.51,19 v15.74,19.23
  Bottom 0.406: 20.64,10.08 27.47,10.08 30.49,13.11 30.49,19.71 31.76,20.98 31.76,21.92 | 20.64,10.08 20.61,10.06 | 20.64,10.08 20.64,14.33 v15.74,19.23
MCLR
  Top 0.254: 10.05,9.26 10.17,9.39
  Top 0.406: JP1.1 6.11,11.2 7.92,9.39 | 7.92,9.39 10.17,9.39 U1.18 | 7.89,9.35 7.92,9.39
  Bottom 0.406: R13.1 5.1,10.56 JP1.1
N$1
  Top 0.305: U2.P$5 22.22,27.01 21.96,26.75 20.18,26.75 18.96,27.97 SJ3.2
N$2
  Top 0.305: SJ2.2 | SJ2.2 19.32,30.4 19.77,29.95 19.77,28.02 20.28,27.51 U2.P$4 | R2.1 17.54,30.43 SJ2.2
N$3
  Top 0.305: U2.P$6 22.63,25.99 22.36,25.73 22.36,23.75 22.06,23.44 20.82,23.44 SJ4.2
N$4
  Top 0.406: LED3.A 32.37,38.22 R22.2
N$5  (via drill 0.5)
  Top 0.406: v34.51,16.69 LED1.A
  Bottom 0.406: R10.2 v34.51,16.69
N$6  (via drill 0.5)
  Top 0.406: LED2.A v32.73,16.74
  Bottom 0.406: v32.73,16.74 32.73,18.07 R21.2
N$10  (via drill 0.5)  (1 unrouted)
  Top 0.305: U2.P$27 23.82,30.57 v24.65,31.39
  Bottom 0.305: C6.1 23.12,33.31 | 23.25,33.17 24.9,33.17 25.03,33.05 25.03,31.78 v24.65,31.39 24.63,31.42 23.53,31.42 22.83,30.72 U$3.2
N$11  (via drill 0.6)  (1 unrouted)
  Top 0.305: U2.P$26 24.32,30.31 24.52,30.51 25.54,30.51 v26.05,31.01
  Bottom 0.305: C5.1 27.74,33.26 | 27.57,33.17 26.3,33.17 26.05,32.92 v26.05,31.01 25.34,30.31 24.32,30.31 23.91,29.89 U$3.1
N$12  (via drill 0.5)
  Top 0.305: U$2.2
  Top 0.406: U$2.2 12.71,47.42 v12.71,48.79
  Bottom 0.406: v12.71,48.79 R7.2
N$13
  Top 0.305: U2.P$17 29.53,27.51 29.98,27.97 30.01,27.97 30.47,28.42 SJ1.2
N$14  (via drill 0.5)
  Top 0.305: U$4.2
  Top 0.406: U$4.2 16.14,47.42 v16.14,48.79
  Bottom 0.406: v16.14,48.79 16.14,45.36 16.27,45.36 R9.2
N$15  (via drill 0.6)
  Top 0.254: U2.P$14 26.82,25.28 27.06,25.04 29.98,25.04 v30.24,24.79
  Bottom 0.254: v30.24,24.79 31.38,24.79 31.38,24.92 31.51,24.91 R3.2
N$16
  Top 0.305: C1.1 23.69,24.66 24.32,25.3 U2.P$9
N$17
  Top 0.305: U2.P$11 25.32,25.36 26.38,24.31 28.09,24.31 R1.1
N$18  (1 unrouted)
PGC
  Top 0.406: U1.16 9.96,10.99 8.39,12.47 8.39,19.33 6.36,21.36 JP1.5
PGD
  Top 0.406: JP1.4 6.87,18.82 7.38,18.31 7.38,11.96 9.16,10.19 U1.17
PWM_RTR1  (2 unrouted)
  Top 0.406: IC4.4 8.33,29.81 8.9,29.24 8.9,24.66 11.95,21.62 11.95,18.82 12.46,18.31 14.49,18.31 15.39,17.41 U1.9
PWM_RTR2  (2 unrouted)
  Top 0.406: U1.10 14.59,16.94 13.98,17.55 11.95,17.55 11.19,18.31 11.19,21.11 8.14,24.16 8.14,25.68 8.01,25.81 7.47,25.81 IC5.4
PWM_RTR_TMP1  (via drill 0.5)
  Top 0.305: IC4.2 v3.57,30.76
  Bottom 0.305: JP4.1 19.57,49.05 20.08,48.54 20.08,38.38 17.54,35.84 4.33,35.84 3.57,35.08 v3.57,30.76
PWM_RTR_TMP2  (via drill 0.5)
  Top 0.305: IC5.2 v3.57,26.7
  Bottom 0.305: v3.57,26.7 3.06,26.7 2.04,27.71 2.04,35.33 3.57,36.86 16.52,36.86 18.81,39.14 18.81,47.78 17.03,49.56 JP4.2
RS485-A
  Top 0.406: U$5.P$5 36.59,3.12 35.01,4.7 34.1,4.7 32.98,5.82 32.98,8.56 IC1.6
RS485-B
  Top 0.406: IC1.7 34.18,6.3 35.06,5.41 35.88,5.41 U$5.P$6
RX  (via drill 0.5)
  Top 0.254: LED1.C 35.23,20.07 35.57,19.74 35.57,14.91 IC1.1 35.37,14.71 v35.37,12.42 | U1.1 23.37,15.99 23.74,15.62 27.09,15.62 30.19,12.52 31.25,12.52 v31.36,12.42
  Bottom 0.254: v31.36,12.42 v35.37,12.42
SCL_3V  (via drill 0.5, 0.6)  (2 unrouted)
  Top 0.305: U2.P$19 28.71,28.51 v28.71,28.5
  Top 0.406: v12.71,33.55 10.43,31.27 10.43,26.85 Q2.2
  Bottom 0.305: v28.71,28.5 22.11,28.5 20.99,29.62 18.3,29.62 17.92,30 17.92,33.05 17.41,33.55 v12.71,33.55 12.72,33.54 R8.1
SCL_5V  (via drill 0.6)
  Top 0.305: U1.41 25.23,11.79 25.46,11.56 27.01,11.56 v27.24,11.79
  Top 0.406: R5.1 12.7,22.79 v11.9,23.6 11.06,24.43 Q2.3 | U1.41
  Bottom 0.406: v27.24,11.79 29.48,14.02 29.48,20.6 28.31,21.72 17.59,21.72 16.98,22.17 16.98,24.46 16.42,25.02 12.26,25.02 11.95,24.71 11.95,23.65 v11.9,23.6 11.9,23.55
SDA_3V  (via drill 0.5)  (2 unrouted)
  Top 0.305: Q1.2 12.95,27.57 | U2.P$20 29.9,29.52 v29.93,29.49
  Top 0.406: 12.95,27.57 v12.97,28.09
  Bottom 0.305: v29.93,29.49 29.93,27.97 29.3,27.33 27.52,27.33 26.78,26.7 14.49,26.7 12.99,28.09 v12.97,28.09 12.75,28.31 R14.1
SDA_5V  (via drill 0.6)
  Top 0.406: v26.07,12.57 23.6,12.57 U1.42 | Q1.3 14.83,24.98 15.3,24.51 15.3,23.85 v15.35,23.8 16.36,22.79 R12.1
  Bottom 0.406: v26.07,12.57 28.46,14.96 28.46,19.84 27.44,20.85 16.67,20.85 15.81,21.72 15.81,23.34 v15.35,23.8 15.3,23.8
SPD1
  Top 0.406: U1.11 13.75,16.03 10.93,16.03 10.43,16.54 10.43,20.6 7.38,23.65 3.11,23.65 2.3,24.46 2.3,32.39 5.65,35.74 15.91,35.74 17.54,37.36 17.54,40.93 U$4.4 17.54,41.11 17.54,42.19 18.05,42.7 R11.1
SPD2
  Top 0.406: U1.14 11.98,12.6 10.05,12.6 9.41,13.23 9.41,20.09 6.62,22.89 2.15,22.89 1.28,23.75 1.28,32.79 5.04,36.55 11.65,36.55 13.98,38.89 13.98,40.93 U$2.4 13.98,41.11 13.98,43.97 15.25,45.24 R6.1
SPEED_1
  Top 0.305: U$2.1 13.89,49.39 12.46,50.83 12.46,51.21 JP4.4
SPEED_2
  Top 0.305: JP4.3 14.49,50.32 15,49.81 16.78,49.81 17.28,49.3 17.28,47.58 U$4.1
TX
  Top 0.254: LED2.C 31.85,20.13 31.51,19.79 31.51,14.86 IC1.4 31.76,14.66 31.76,13.54 32.32,12.98 32.32,11.46 32.27,11.51 29.88,11.51 27.2,14.19 U1.44